# EAGLE design Head Lights (EAGLE 9.6.2)
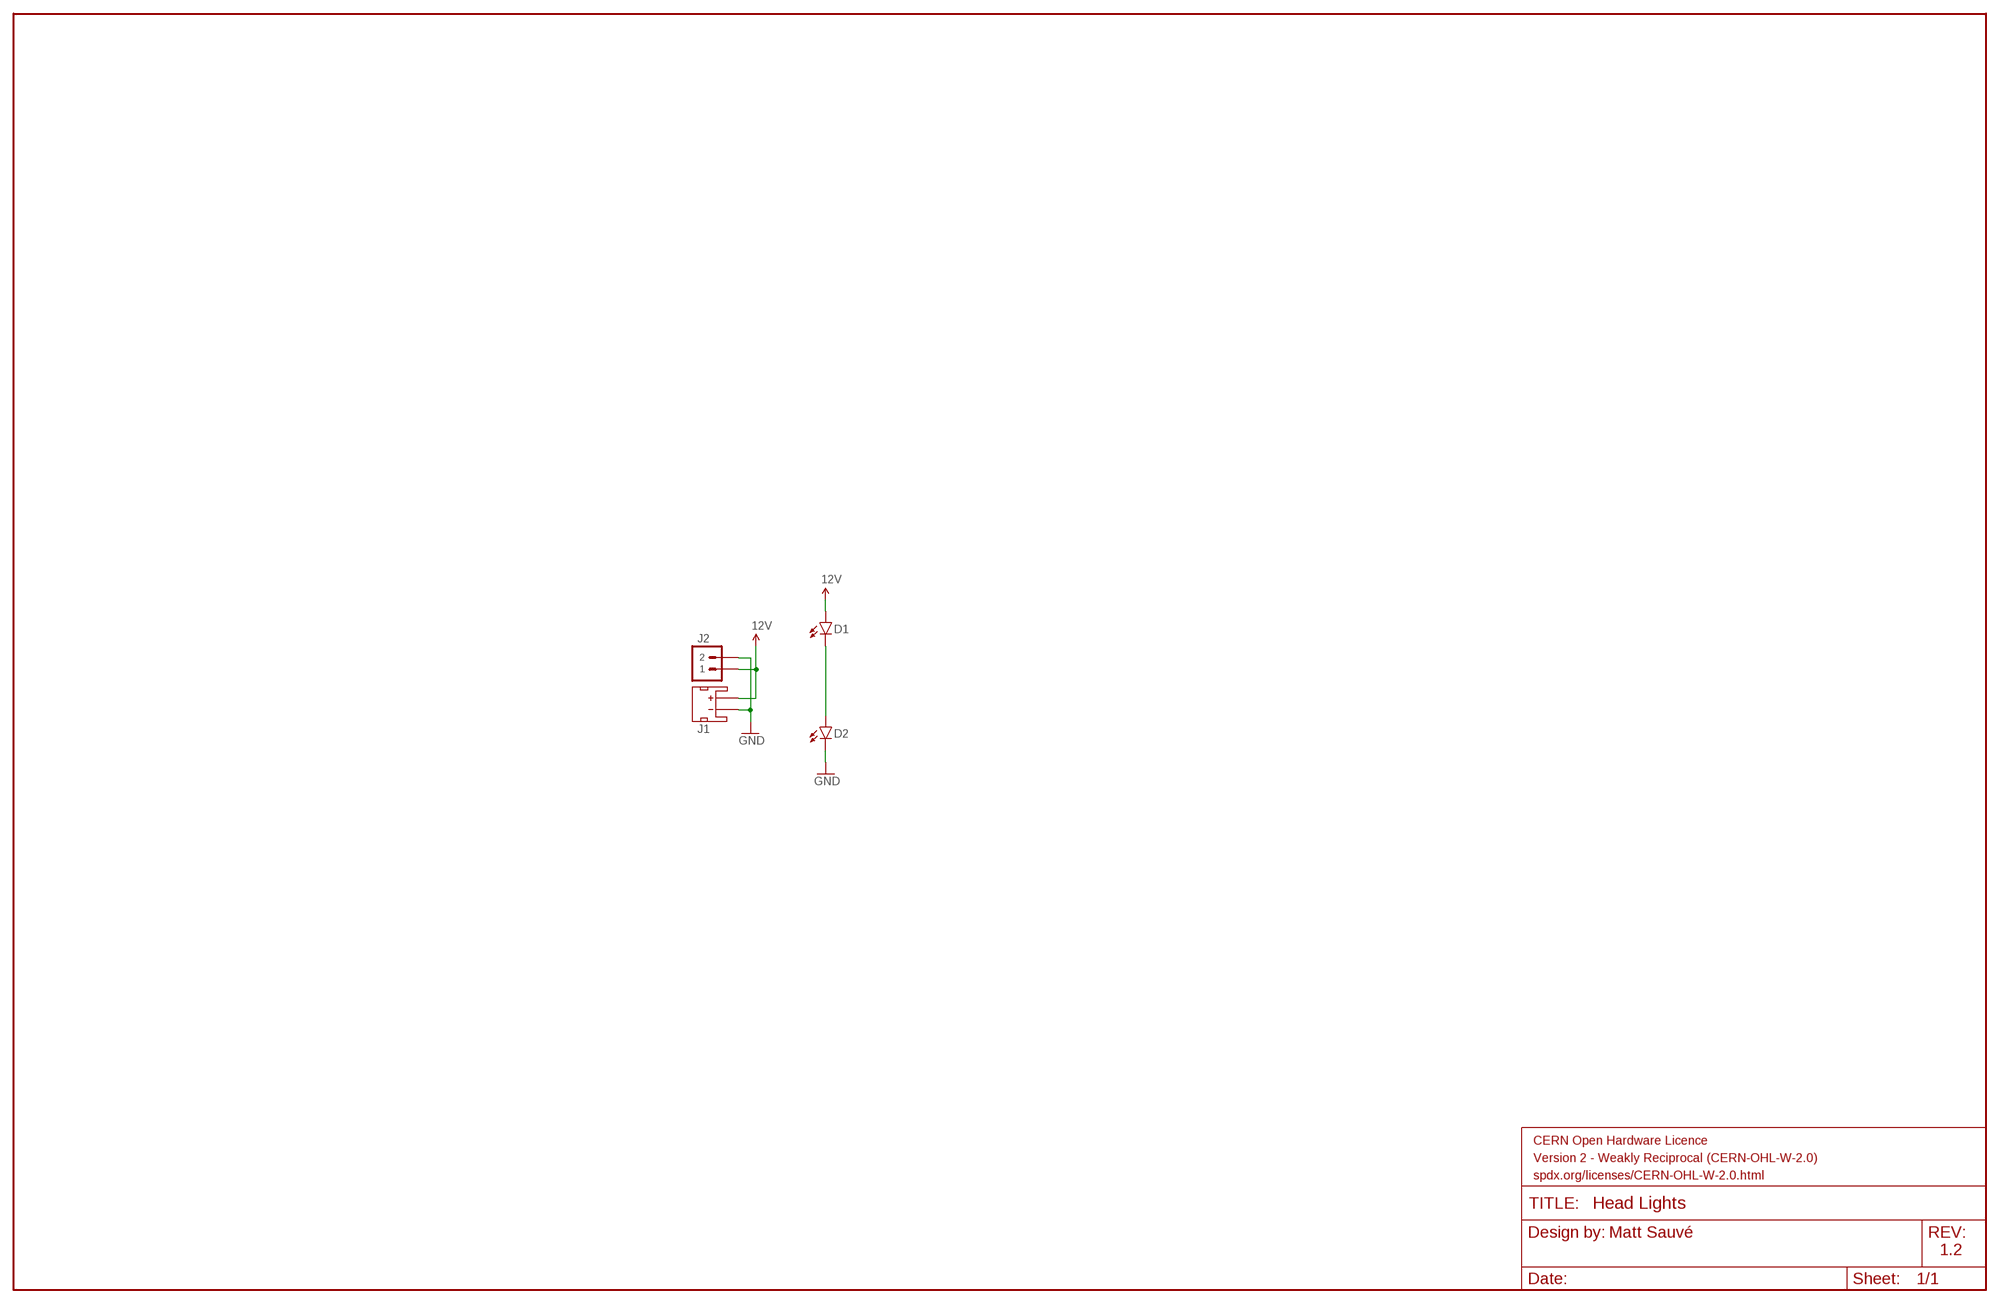
[diagram p0: schematic, sheet 1]

## Parts
D1  WHITE_LUXEON_LED  [1414]
D2  WHITE_LUXEON_LED  [1414]
FRAME1  FRAME-LEDGER_CERN_WEAK  [CERN_WEAK]
J1  JST_2MM_MALE  [JST-2-SMD]
J2  JST_PH_2POS  [JST_PH_2POS]

## Nets
12V: D1.P$1(A) J1.2(+) J2.1
GND: D2.P$2(C) J1.1(-) J2.2
N$2: D1.P$2(C) D2.P$1(A)
Unconnected: J1.NC1(PAD1) J1.NC2(PAD2)

## Notes on the sheet
- Matt Sauvé
- 1.2

## Library data of the parts
D1 D2 = SAUVE:WHITE_LUXEON_LED; MFPN: MXA7-PW40-S001
FRAME1 = SAUVE:FRAME-LEDGER_CERN_WEAK: Schematic Frame - Ledger Standard 11x14 US Ledger frame
J1 = SparkFun-Connectors:JST_2MM_MALE: Mates to single-cell LiPo batteries. CONN-11443 Now with smashable polarity marks!; BTM_NEG: -; BTM_POS: +; PROD_ID: CONN-11443; TOP_NEG: -; TOP_POS: +
J2 = SAUVE:JST_PH_2POS

## Board
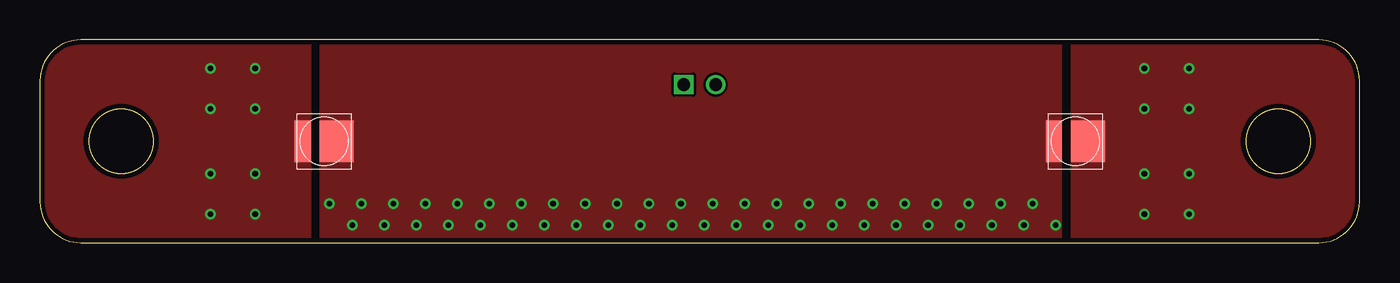
[diagram p1: board, top side]
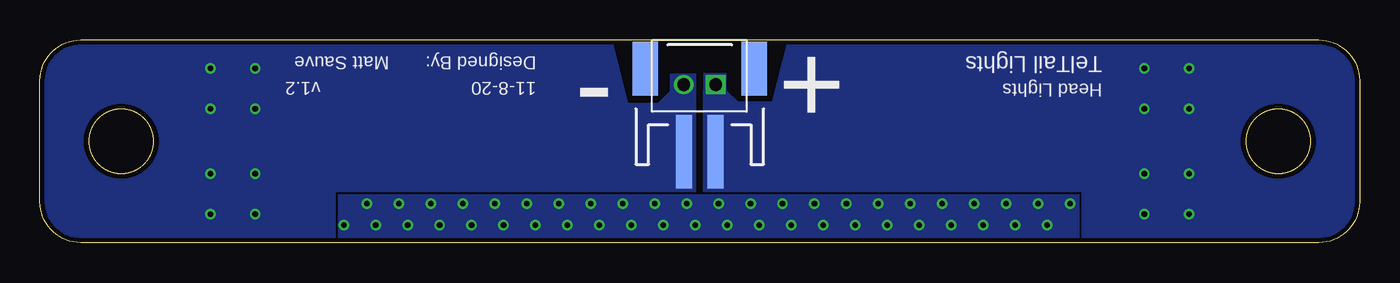
[diagram p2: board, bottom side, seen from below]

Size 82.55 x 12.7 mm. Coordinates in mm from the lower left corner, seen from the top.
Outline: 0,10.16 0,2.54 arc90 2.54,0 80.01,0 arc90 82.55,2.54 82.55,10.16 arc90 80.01,12.7 2.54,12.7 arc90 0,10.16
Outline: circle at 77.47,6.35 radius 2
Outline: circle at 5.08,6.35 radius 2
Copper layers (1*16): Top 0.035mm / dielectric 1.5mm / Bottom 0.035mm
Design rules "ALLPCB": minimum track width 6mil, minimum drill 12mil, track to track 6mil, track to pad 6mil, pad to pad 6mil, via to via 6mil, smd to smd 6mil, copper to edge 12mil, drill to drill 12mil, minimum pad ring 7mil, minimum via ring 6mil, stop-mask expansion 0mil, vias tented up to drill 0.35mm, thermal gap 10mil

### Footprints (pad centres in the part's own frame; a part is rotated, then mirrored left to right if it is on the bottom)
1414 = smd 2.6 x 1.02: P$1 0,1.34 | smd 2.6 x 2.13: P$2 0,-0.785
JST-2-SMD = smd 1 x 4.6: 1 -1,-3.7; 2 1,-3.7 | smd 1.6 x 3.4: NC1 -3.4,1.5; NC2 3.4,1.5
JST_PH_2POS = drill 0.8 square: 1 -1.028,0 | drill 0.8: 2 0.972,0

### Placement (x,y rotation side)
D1  17.78,6.35 90 top
D2  64.77,6.35 90 top
FRAME1  0.6,-11.1 0 top  (outside the outline)
J1  41.27,9.4 0 bottom
J2  41.3,9.9 180 bottom

### Tracks (layer width: path | path; a pad name or v marks a point on that pad's centre or on a via)
12V  (via drill 0.35)
  other vias: 13.46,4.32 10.67,4.32 13.46,1.78 10.67,1.78 13.46,10.92 10.67,10.92 10.67,8.38 13.46,8.38
  pour Bottom (rank 6, no thermals): 0,12.7 35.77,12.7 36.75,8.8 38.89,8.8 39.6,9.5 39.6,10.6 41.05,10.6 41.07,8.59 41.07,0 0,0
  pour Top (no thermals): 0,12.7 16.93,12.7 16.93,0 0,0
GND  (via drill 0.35)
  other vias: 69.09,8.38 71.88,8.38 71.88,10.92 69.09,10.92 71.88,1.78 71.88,4.32 69.09,4.32 69.09,1.78
  pour Bottom (rank 6, no thermals): 46.8,12.7 45.81,8.75 43.85,8.75 43.1,9.5 43.1,10.6 41.55,10.6 41.53,10.58 41.53,8.64 41.53,0 82.55,0 82.55,12.7
  pour Top (no thermals): 64.52,12.7 82.55,12.7 82.55,0 64.52,0
N$2  (via drill 0.35)
  other vias: 18.1,2.45 19.55,1.1 21.55,1.1 23.55,1.1 25.55,1.1 27.55,1.1 29.55,1.1 31.55,1.1 33.55,1.1 35.55,1.1 37.55,1.1 39.55,1.1 41.55,1.1 43.55,1.1 45.55,1.1 47.55,1.1 49.55,1.1 51.55,1.1 53.55,1.1 55.55,1.1 57.55,1.1 59.55,1.1 61.55,1.1 63.55,1.1 20.1,2.45 22.1,2.45 24.1,2.45 26.1,2.45 28.1,2.45 30.1,2.45 32.1,2.45 34.1,2.45 36.1,2.45 38.1,2.45 40.1,2.45 42.1,2.45 44.1,2.45 46.1,2.45 48.1,2.45 50.1,2.45 52.1,2.45 54.1,2.45 56.1,2.45 58.1,2.45 60.1,2.45 62.1,2.45
  pour Top (no thermals): 17.53,12.7 63.91,12.7 63.91,0 17.53,0
  pour Bottom (no thermals): 17.53,3 63.91,3 63.91,0 17.53,0

### Text on the board
bPlace: TelTail Lights | Designed By: | Matt Sauve | Head Lights | 11-8-20 | v1.2 | + | -